# Altium schematic sheet PMC_conn.SchDoc
size A4
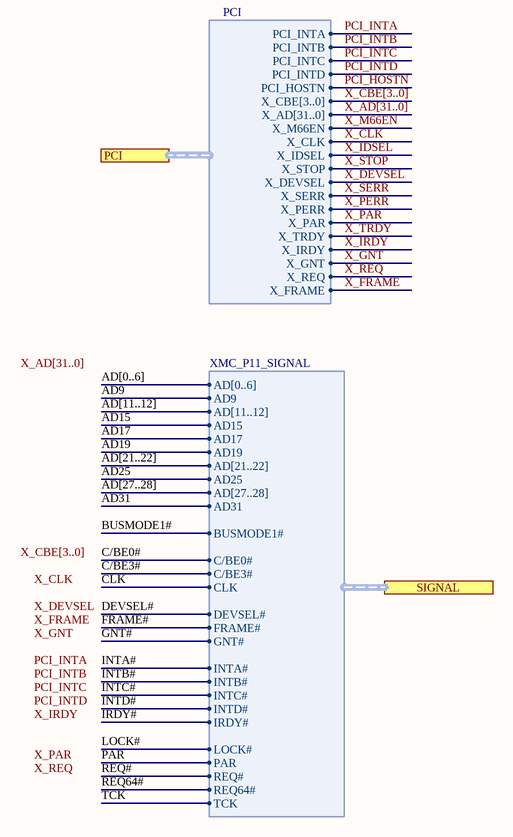
[diagram p0: PMC_conn.SchDoc]

## Ports
PCI (harness PCI), SIGNAL (harness XMC_P11_SIGNAL)

## Harnesses
PCI: PCI_INTA, PCI_INTB, PCI_INTC, PCI_INTD, PCI_HOSTN, X_CBE[3..0], X_AD[31..0], X_M66EN, X_CLK, X_IDSEL, X_STOP, X_DEVSEL, X_SERR, X_PERR, X_PAR, X_TRDY, X_IRDY, X_GNT, X_REQ, X_FRAME
XMC_P11_SIGNAL: BUSMODE1#, C/BE0#, C/BE3#, CLK, DEVSEL#, FRAME#, GNT#, INTA#, INTB#, INTC#, INTD#, IRDY#, LOCK#, PAR, REQ64#, REQ#, TCK, AD9, AD15, AD17, AD19, AD25, AD31, AD[0..6], AD[11..12], AD[21..22], AD[27..28]

## Nets
AD9: port SIGNAL.AD9
AD15: port SIGNAL.AD15
AD17: port SIGNAL.AD17
AD19: port SIGNAL.AD19
AD25: port SIGNAL.AD25
AD31: port SIGNAL.AD31
BUSMODE1#: port SIGNAL.BUSMODE1#
C/BE0#: port SIGNAL.C/BE0#
C/BE3#: port SIGNAL.C/BE3#
CLK: port SIGNAL.CLK
DEVSEL#: port SIGNAL.DEVSEL#
FRAME#: port SIGNAL.FRAME#
GNT#: port SIGNAL.GNT#
INTA#: port SIGNAL.INTA#
INTB#: port SIGNAL.INTB#
INTC#: port SIGNAL.INTC#
INTD#: port SIGNAL.INTD#
IRDY#: port SIGNAL.IRDY#
LOCK#: port SIGNAL.LOCK#
PAR: port SIGNAL.PAR
PCI_HOSTN: port PCI.PCI_HOSTN
PCI_INTA: port PCI.PCI_INTA
PCI_INTB: port PCI.PCI_INTB
PCI_INTC: port PCI.PCI_INTC
PCI_INTD: port PCI.PCI_INTD
REQ64#: port SIGNAL.REQ64#
REQ#: port SIGNAL.REQ#
TCK: port SIGNAL.TCK
X_CLK: port PCI.X_CLK
X_DEVSEL: port PCI.X_DEVSEL
X_FRAME: port PCI.X_FRAME
X_GNT: port PCI.X_GNT
X_IDSEL: port PCI.X_IDSEL
X_IRDY: port PCI.X_IRDY
X_M66EN: port PCI.X_M66EN
X_PAR: port PCI.X_PAR
X_PERR: port PCI.X_PERR
X_REQ: port PCI.X_REQ
X_SERR: port PCI.X_SERR
X_STOP: port PCI.X_STOP
X_TRDY: port PCI.X_TRDY

## Buses and harness runs
bus AD[0..6]
bus AD[11..12]
bus AD[21..22]
bus AD[27..28]
bus X_AD[31..0]
bus X_CBE[3..0]

## Notes on the sheet
- Labels drawn without touching a wire or pin: PCI_INTA, PCI_INTB, PCI_INTC, PCI_INTD, X_AD[31..0], X_CBE[3..0], X_CLK, X_DEVSEL, X_FRAME, X_GNT, X_IRDY, X_PAR, X_REQ